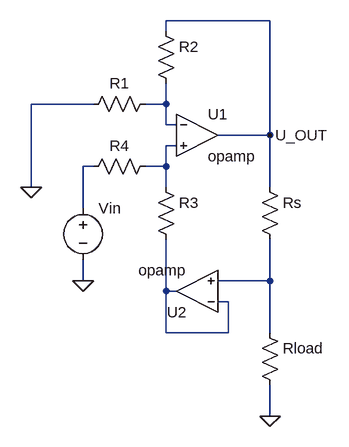
[diagram p0: schematic Ideal.asc]
Ideal.asc, the LTspice schematic file:
Version 4
SHEET 1 880 680
WIRE 272 -80 112 -80
WIRE 112 -64 112 -80
WIRE 0 48 -96 48
WIRE 112 48 112 16
WIRE 112 48 80 48
WIRE 112 80 112 48
WIRE 128 80 112 80
WIRE 272 96 272 -80
WIRE 272 96 192 96
WIRE 128 112 112 112
WIRE 0 144 -16 144
WIRE 112 144 112 112
WIRE 112 144 80 144
WIRE -96 176 -96 48
WIRE 112 176 112 144
WIRE 272 176 272 96
WIRE -16 208 -16 144
WIRE -16 320 -16 288
WIRE 272 320 272 256
WIRE 272 320 192 320
WIRE 112 336 112 256
WIRE 128 336 112 336
WIRE 208 352 192 352
WIRE 112 400 112 336
WIRE 208 400 208 352
WIRE 208 400 112 400
WIRE 272 400 272 320
WIRE 272 528 272 480
FLAG 272 528 0
FLAG -96 176 0
FLAG -16 320 0
FLAG 272 96 U_OUT
SYMBOL Opamps\\opamp 160 32 R0
SYMATTR InstName U1
SYMBOL Opamps\\opamp 160 400 R180
SYMATTR InstName U2
SYMBOL res 96 160 R0
SYMATTR InstName R3
SYMATTR Value ""
SYMBOL res 96 128 R90
WINDOW 0 0 56 VBottom 2
WINDOW 3 32 56 VTop 2
SYMATTR InstName R4
SYMATTR Value ""
SYMBOL res 96 32 R90
WINDOW 0 0 56 VBottom 2
WINDOW 3 32 56 VTop 2
SYMATTR InstName R1
SYMATTR Value ""
SYMBOL res 96 -80 R0
SYMATTR InstName R2
SYMATTR Value ""
SYMBOL res 256 160 R0
SYMATTR InstName Rs
SYMATTR Value ""
SYMBOL res 256 384 R0
SYMATTR InstName Rload
SYMATTR Value ""
SYMBOL voltage -16 192 R0
SYMATTR InstName Vin
SYMATTR Value ""

The netlist it stands for:
* Ideal.asc
XU1 N001 N002 U_OUT opamp Aol=100K GBW=10Meg  ; pins invin noninvin out
XU2 N005 N004 N005 opamp Aol=100K GBW=10Meg  ; pins invin noninvin out
R3 N002 N005
R4 N002 N003
R1 N001 0
R2 U_OUT N001
Rs U_OUT N004
Rload N004 0
Vin N003 0
.backanno
.end